# EAGLE design CC2-32KEC-V1RA (EAGLE 5.10)
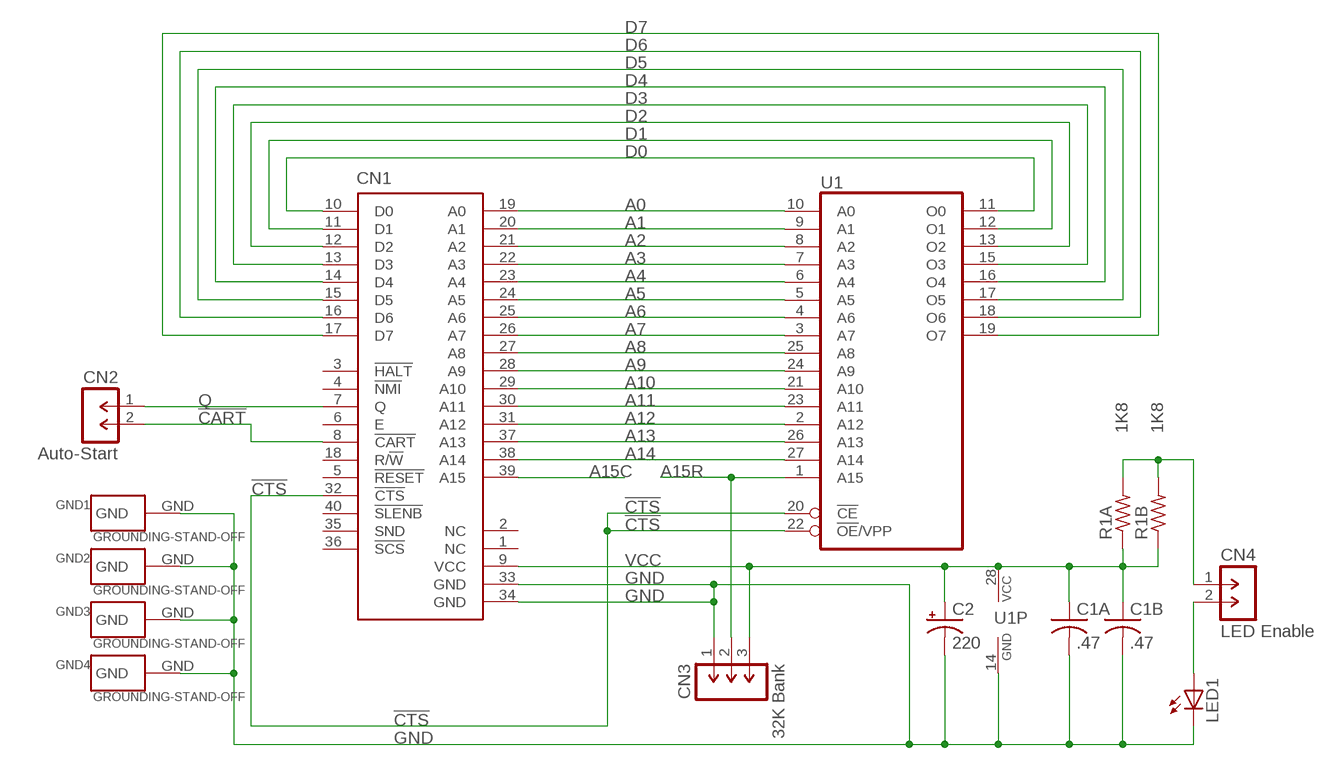
[diagram p0: schematic, sheet 1]

## Parts
C1A  .47  NP-CAPACITOR-C050-025X075  [C050-025X075]
C1B  .47  NP-CAPACITOR-C1206K  [C1206K]
C2  220  P-CAPACITOR-CPOL-RADIAL-1  [CPOL-RADIAL-1]
CN1  COCO3-CARTRIDGE-PLUG-SHORT  [EDGE-CARD-PLUG-2X20-100-SHORT]
CN2  Auto-Start  1X02-SIP-100-32  [SIL1X02-100]
CN3  32K Bank  1X03-SIP-100-32  [SIL1X03-100]
CN4  LED Enable  1X02-SIP-100-32  [SIL1X02-100]
GND1  GROUNDING-STAND-OFF  [STAND-OFF]
GND2  GROUNDING-STAND-OFF  [STAND-OFF]
GND3  GROUNDING-STAND-OFF  [STAND-OFF]
GND4  GROUNDING-STAND-OFF  [STAND-OFF]
LED1  LED5MM  [LED5MM]
R1A  1K8  R-US_0207/10  [0207/10]
R1B  1K8  R-US_M1206  [M1206]
U1  27C512D-MINIMAL-OUTLINE  [DIL28-6-MINIMAL-OUTLINE]

## Nets
!CART: CN1.8(!CART) CN2.2
!CTS: CN1.32(!CTS) U1.20(!CE) U1.22(!OE!/VPP)
A0: CN1.19(A0) U1.10(A0)
A1: CN1.20(A1) U1.9(A1)
A2: CN1.21(A2) U1.8(A2)
A3: CN1.22(A3) U1.7(A3)
A4: CN1.23(A4) U1.6(A4)
A5: CN1.24(A5) U1.5(A5)
A6: CN1.25(A6) U1.4(A6)
A7: CN1.26(A7) U1.3(A7)
A8: CN1.27(A8) U1.25(A8)
A9: CN1.28(A9) U1.24(A9)
A10: CN1.29(A10) U1.21(A10)
A11: CN1.30(A11) U1.23(A11)
A12: CN1.31(A12) U1.2(A12)
A13: CN1.37(A13) U1.26(A13)
A14: CN1.38(A14) U1.27(A14)
A15C: CN1.39(A15)
A15R: CN3.2 U1.1(A15)
D0: CN1.10(D0) U1.11(O0)
D1: CN1.11(D1) U1.12(O1)
D2: CN1.12(D2) U1.13(O2)
D3: CN1.13(D3) U1.15(O3)
D4: CN1.14(D4) U1.16(O4)
D5: CN1.15(D5) U1.17(O5)
D6: CN1.16(D6) U1.18(O6)
D7: CN1.17(D7) U1.19(O7)
GND [power]: C1A.2(-) C1B.2(-) C2.2(-) CN1.33(GND) CN1.34(GND) CN3.1 GND1.GND GND2.GND GND3.GND GND4.GND LED1.K(C) U1.14(GND)
N$1: CN4.1 R1A.2 R1B.2
N$2: CN4.2 LED1.A
Q: CN1.7(Q) CN2.1
VCC [power]: C1A.1(+) C1B.1(+) C2.1(+) CN1.9(VCC) CN3.3 R1A.1 R1B.1 U1.28(VCC)
Unconnected: CN1.1(NC) CN1.2(NC) CN1.3(!HALT) CN1.4(!NMI) CN1.5(!RESET) CN1.6(E) CN1.18(R/!W) CN1.35(SND) CN1.36(!SCS) CN1.40(!SLENB)

## Library data of the parts
C1A C1B = RetroZilla.org-Capacitor:NP-CAPACITOR: NON-POLARIZED CAPACITOR grid 5mm
C2 = RetroZilla.org-Capacitor:P-CAPACITOR: POLARIZED CAPACITOR Small Radial Electrolytic
CN1 = RetroZilla.org-TRS-80-CoCo-3-Program-Pak-Cartridge:COCO3-CARTRIDGE-PLUG: CoCo 3 Program Pak Cartridge Plug - http://www.GIMEchip.com/ Tandy Radio Shack TRS-80 Color Computer 3 Program Pak Cartridge Plug (Edge-Card) E.A.G.L.E. Library Part created by John Eric Turner & His Father - sales@gimechip.com <mailto:sales@gimechip.com?subject=Tandy Radio Shack TRS- 80 Color Computer 3 Program Pak Cartridge Plug (Edge-Card) E.A.G.L.E. Library Part> 40-Pin Edge-Card sharing the same pinout as the Program Pak Cartridge Edge-Card Connector. This library part has been designed to provide a 40-pin cartridge plug connector matching the CoCo's Edge-Card connector (Cartridge Slot). This library part is also useful with the Dragon and other CoCo clones. It is important to note that the CoCo 2 & 3 only provide +5V at the cartridge connector. The CoCo 1 provides +5V AND +/-12V at the cartridge connector. The Dragon provides only +5V and +12V at the cartridge connector. The table below lists all similarities and differences between these machines, relevant to the cartridge slot: PIN # TRS-80 "CoCo 1" Function Tano/Dragon Data "Dragon 32/64" Function TRS-80 "CoCo 2 & 3" Function 1 -12V +12V NC 2 +12V +12V NC 3 HALT* HALT* HALT* 4 NMI* NMI* NMI* 5 RESET* RESET* RESET* 6 E E E 7 Q Q Q 8 CART* CART* CART* 9 +5V +5V +5V 10 D0 D0 D0 11 D1 D1 D1 12 D2 D2 D2 13 D3 D3 D3 14 D4 D4 D4 15 D5 D5 D5 16 D6 D6 D6 17 D7 D7 D7 18 R/W* R/W* R/W* 19 A0 A0 A0 20 A1 A1 A1 21 A2 A2 A2 22 A3 A3 A3 23 A4 A4 A4 24 A5 A5 A5 25 A6 A6 A6 26 A7 A7 A7 27 A8 A8 A8 28 A9 A9 A9 29 A10 A10 A10 30 A11 A11 A11 31 A12 A12 A12 32 CTS* CSEL* CTS* 33 GND GND GND 34 GND GND GND 35 SND SND SND 36 SCS* P2* SCS* 37 A13 A13 A13 38 A14 A14 A14 39 A15 A15 A15 40 SLENB* DSD* SLENB*
CN2 CN4 = RetroZilla.org-Header-Generic:1X02: MALE HEADER
CN3 = RetroZilla.org-Header-Generic:1X03: MALE HEADER
GND1-GND4 = RetroZilla.org-TRS-80-CoCo-3-Program-Pak-Cartridge:GROUNDING
LED1 = RetroZilla.org-LED:LED: LED OSRAM: - CHIPLED LG R971, LG N971, LY N971, LG Q971, LY Q971, LO R971, LY R971 LH N974, LH R974 LS Q976, LO Q976, LY Q976 LO Q996 - Hyper CHIPLED LW Q18S LB Q993, LB Q99A, LB R99A - SideLED LS A670, LO A670, LY A670, LG A670, LP A670 LB A673, LV A673, LT A673, LW A673 LH A674 LY A675 LS A676, LA A676, LO A676, LY A676, LW A676 LS A679, LY A679, LG A679 - Hyper Micro SIDELED® LS Y876, LA Y876, LO Y876, LY Y876 LT Y87S - SmartLED LW L88C, LW L88S LB L89C, LB L89S, LG L890 LS L89K, LO L89K, LY L89K LS L896, LA L896, LO L896, LY L896 - TOPLED LS T670, LO T670, LY T670, LG T670, LP T670 LSG T670, LSP T670, LSY T670, LOP T670, LYG T670 LG T671, LOG T671, LSG T671 LB T673, LV T673, LT T673, LW T673 LH T674 LS T676, LA T676, LO T676, LY T676, LB T676, LH T676, LSB T676, LW T676 LB T67C, LV T67C, LT T67C, LS T67K, LO T67K, LY T67K, LW E67C LS E67B, LA E67B, LO E67B, LY E67B, LB E67C, LV E67C, LT E67C LW T67C LS T679, LY T679, LG T679 LS T770, LO T770, LY T770, LG T770, LP T770 LB T773, LV T773, LT T773, LW T773 LH T774 LS E675, LA E675, LY E675, LS T675 LS T776, LA T776, LO T776, LY T776, LB T776 LHGB T686 LT T68C, LB T68C - Hyper Mini TOPLED® LB M676 - Mini TOPLED Santana® LG M470 LS M47K, LO M47K, LY M47K Source: http://www.osram.convergy.de/
R1A R1B = RetroZilla.org-RCL:R-US_: RESISTOR, American symbol
U1 = RetroZilla.org-EPROM:27C512D: MEMORY

## Net classes
0 default: width 0.203 mm, clearance 0.203 mm
1 power: width 0.635 mm, clearance 0.203 mm

## Board
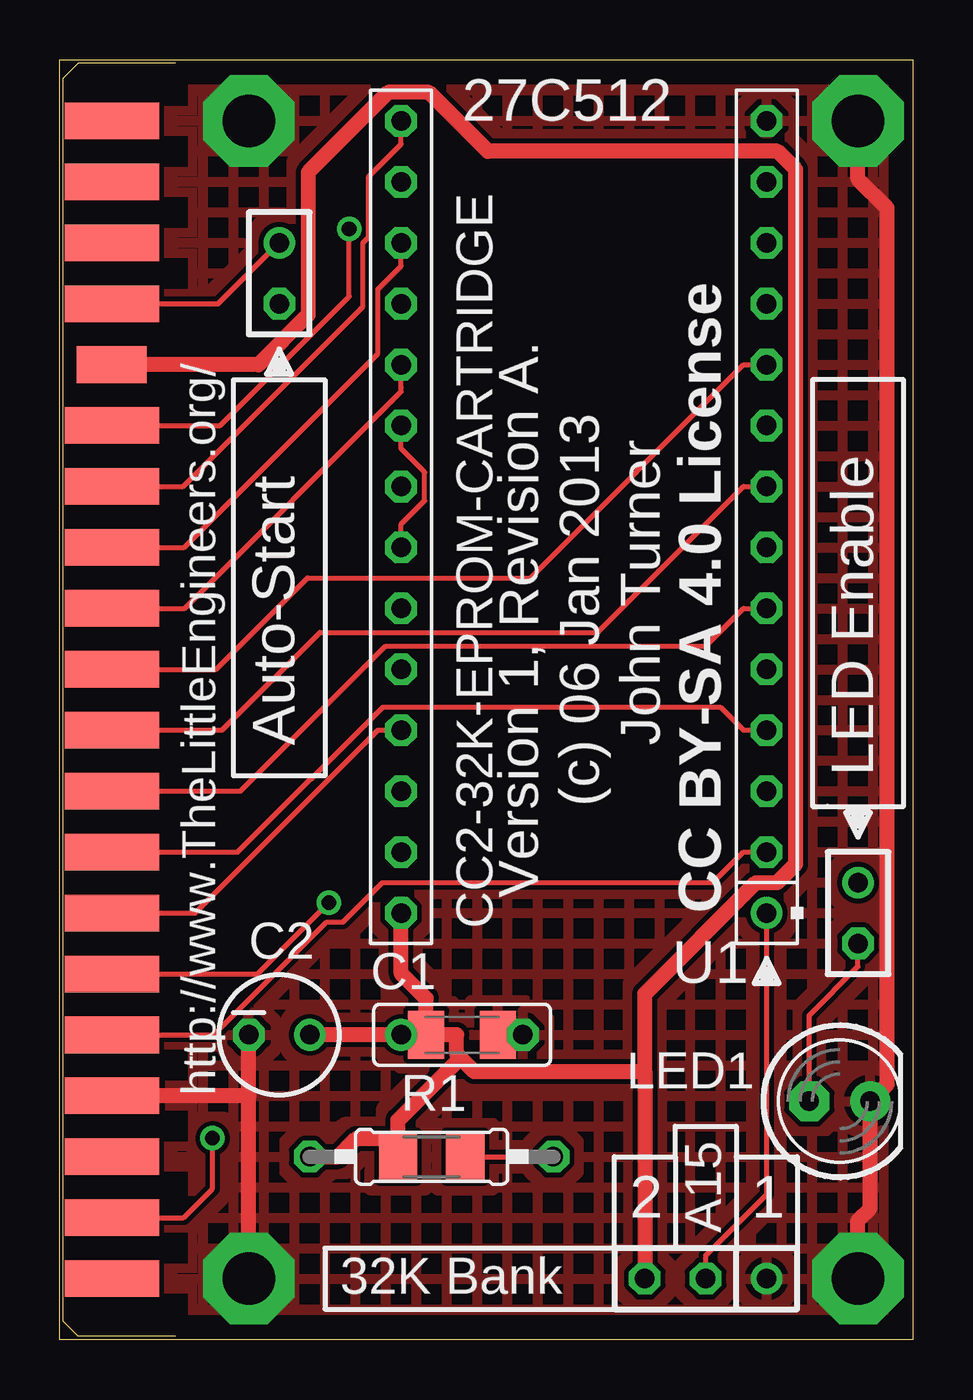
[diagram p1: board, top side]
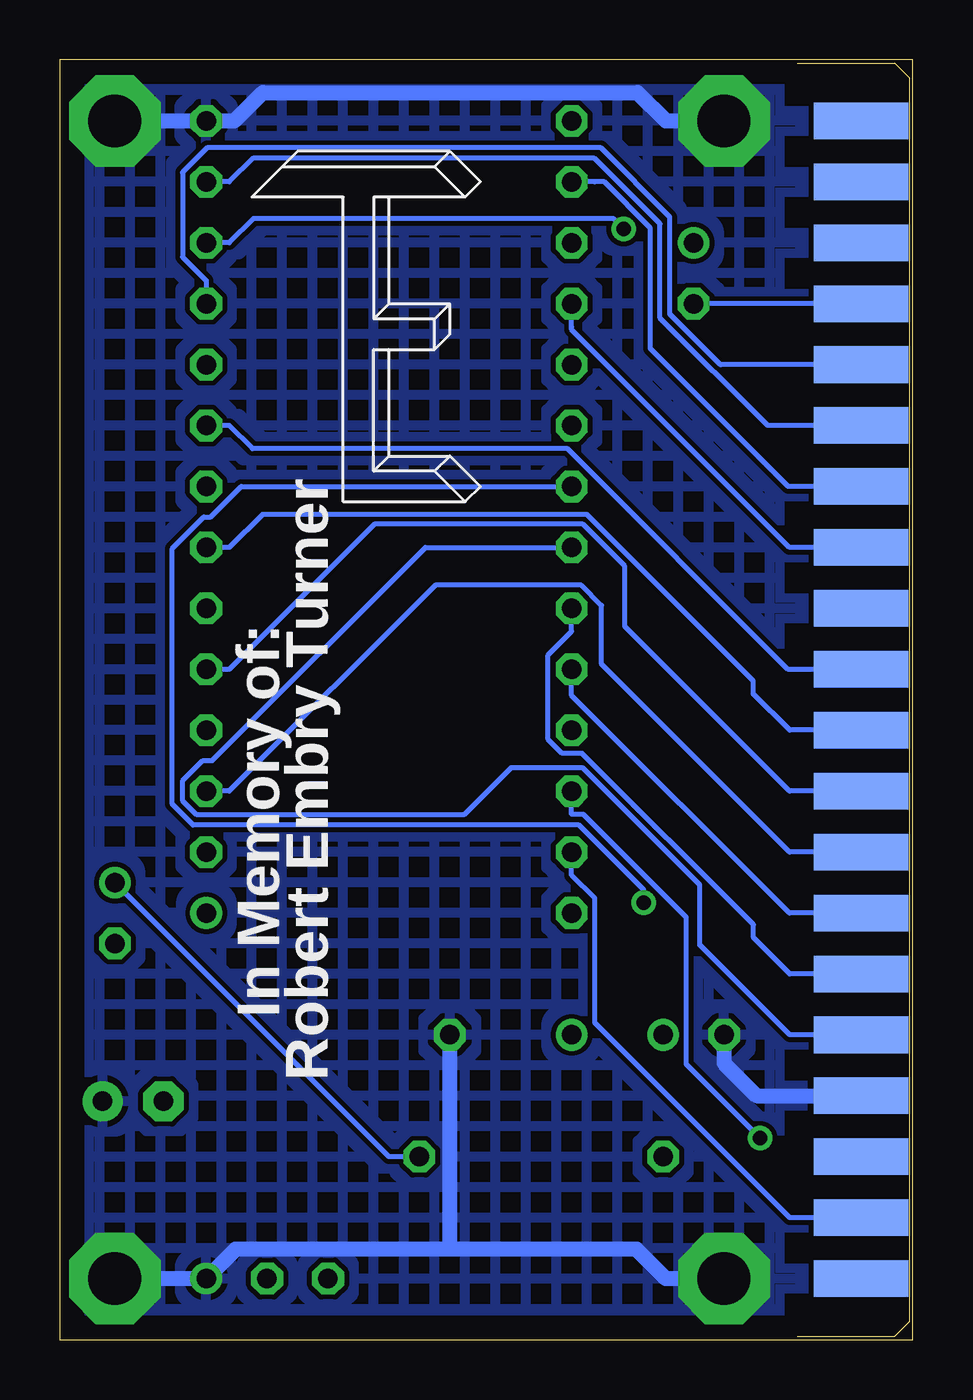
[diagram p2: board, bottom side, seen from below]

Size 35.56 x 53.34 mm. Coordinates in mm from the lower left corner, seen from the top.
Outline: 0,53.34 35.56,53.34 35.56,0 0,0 0,53.34
Copper layers (1*16): Top 0.035mm / dielectric 1.5mm / Bottom 0.035mm
Design rules "default": minimum track width 10mil, minimum drill 24mil, track to track 8mil, track to pad 8mil, pad to pad 8mil, via to via 8mil, smd to smd 8mil, copper to edge 40mil, drill to drill 8mil, minimum pad ring 10mil, minimum via ring 8mil, stop-mask expansion 4mil, vias tented up to drill 0mil, thermal gap 10mil
vRestrict: area 15.5,14 to 28.2,53.3; area 23.1,3.8 to 30.7,7.6; area 9.1,0 to 23.1,5.1; area 30.7,20.3 to 35.8,48.3; area 7.9,16.5 to 10.4,41.9

### Footprints (pad centres in the part's own frame; a part is rotated, then mirrored left to right if it is on the bottom)
C050-025X075 = drill 0.813 round: 1 -2.54,0 | drill 0.813 octagon: 2 2.54,0
C1206K = smd 1.5 x 2: 1 -1.5,0; 2 1.5,0
CPOL-RADIAL-1 = drill 0.813 round: 1 1.27,0 | drill 0.813 octagon: 2 -1.27,0
EDGE-CARD-PLUG-2X20-100-SHORT = smd 3.937 x 1.524: 1 3.175,24.13; 3 3.175,21.59; 5 3.175,19.05; 7 3.175,16.51; 11 3.175,11.43; 13 3.175,8.89; 15 3.175,6.35; 17 3.175,3.81; 19 3.175,1.27; 21 3.175,-1.27; 23 3.175,-3.81; 25 3.175,-6.35; 27 3.175,-8.89; 29 3.175,-11.43; 31 3.175,-13.97; 33 3.175,-16.51; 35 3.175,-19.05; 37 3.175,-21.59; 39 3.175,-24.13 | smd 3.937 x 1.524 bottom: 2 3.175,24.13; 4 3.175,21.59; 6 3.175,19.05; 8 3.175,16.51; 10 3.175,13.97; 12 3.175,11.43; 14 3.175,8.89; 16 3.175,6.35; 18 3.175,3.81; 20 3.175,1.27; 22 3.175,-1.27; 24 3.175,-3.81; 26 3.175,-6.35; 28 3.175,-8.89; 30 3.175,-11.43; 32 3.175,-13.97; 34 3.175,-16.51; 36 3.175,-19.05; 38 3.175,-21.59; 40 3.175,-24.13 | smd 2.921 x 1.524: 9 3.175,13.97
SIL1X02-100 = drill 0.813 round: 1 -1.27,0 | drill 0.813 octagon: 2 1.27,0
SIL1X03-100 = drill 0.813 round: 1 -2.54,0 | drill 0.813 octagon: 2 0,0; 3 2.54,0
STAND-OFF = drill 2.2 pad 3.81 octagon: GND 0,0
LED5MM = drill 0.813 pad 1.676 octagon: A -1.27,0 | drill 0.813 pad 1.676 round: K 1.27,0
0207/10 = drill 0.813 octagon: 1 -5.08,0; 2 5.08,0
M1206 = smd 1.6 x 2: 1 -1.4,0; 2 1.4,0
DIL28-6-MINIMAL-OUTLINE = drill 0.813 round: 1 -16.51,-7.62 | drill 0.813 octagon: 2 -13.97,-7.62; 3 -11.43,-7.62; 4 -8.89,-7.62; 5 -6.35,-7.62; 6 -3.81,-7.62; 7 -1.27,-7.62; 8 1.27,-7.62; 9 3.81,-7.62; 10 6.35,-7.62; 11 8.89,-7.62; 12 11.43,-7.62; 13 13.97,-7.62; 14 16.51,-7.62; 15 16.51,7.62; 16 13.97,7.62; 17 11.43,7.62; 18 8.89,7.62; 19 6.35,7.62; 20 3.81,7.62; 21 1.27,7.62; 22 -1.27,7.62; 23 -3.81,7.62; 24 -6.35,7.62; 25 -8.89,7.62; 26 -11.43,7.62; 27 -13.97,7.62; 28 -16.51,7.62

### Placement (x,y rotation side)
C1A  16.76,12.7 0 top
C1B  16.76,12.7 0 top
C2  9.14,12.7 0 top
CN1  -1.02,26.67 0 top
CN2  9.14,44.45 270 top
CN3  26.92,2.54 180 top
CN4  33.27,17.78 270 top
GND1  7.87,50.8 0 top
GND2  33.27,50.8 0 top
GND3  7.87,2.54 0 top
GND4  33.27,2.54 0 top
LED1  32.51,9.93 0 top
R1A  15.49,7.62 0 top
R1B  15.49,7.62 0 top
U1  21.84,34.29 90 top
U$1  [TLE-LOGO-7]  27.56,34.92 0 bottom

### Tracks (layer width: path | path; a pad name or v marks a point on that pad's centre or on a via)
!CART
  Bottom 0.203: CN1.8 CN2.2
!CTS
  Top 0.203: U1.20 14.22,37.13 15.21,36.15 15.21,34.97 14.22,33.98 U1.22
  Bottom 0.203: U1.22 20.32,33.02 29.21,24.13 29.61,24.13 30.44,23.3 30.44,22.46 29.86,21.87 18.71,21.87 16.76,23.83 13.76,23.83 8.88,18.95 8.88,16.45 5.14,12.7 CN1.32
A0
  Top 0.203: U1.10 28.5,40.64 19.61,31.75 10.31,31.75 6.5,27.94 CN1.19
A1
  Bottom 0.203: U1.9 28.5,38.1 27.53,37.13 14.4,37.13 5.21,27.94 CN1.20
A2
  Top 0.203: U1.8 28.5,35.56 22.42,29.48 10.84,29.48 6.76,25.4 CN1.21
A3
  Bottom 0.203: U1.7 28.5,33.02 27.12,34.4 13.59,34.4 6.65,27.46 6.65,26.92 5.13,25.4 CN1.22
A4
  Top 0.203: CN1.23 7.53,22.86 13.57,28.91 26.92,28.91 28.5,30.48 U1.6
A5
  Bottom 0.203: CN1.24 5.14,22.86 12,29.72 12,32.24 13.75,33.99 22.45,33.99 28.5,27.94 U1.5
A6
  Top 0.203: CN1.25 4.43,20.32 7.42,20.32 13.46,26.37 27.53,26.37 28.5,25.4 U1.4
A7
  Bottom 0.203: U1.3 28.5,22.86 19.91,31.45 13.83,31.45 12.98,30.6 12.98,28.16 5.14,20.32 CN1.26
A8
  Top 0.203: CN1.27 5.64,17.78 13.26,25.4 U1.25
A9
  Bottom 0.203: U1.24 14.22,26.86 5.15,17.78 CN1.28
A10  (via drill 0.61 pad 1.02)
  Top 0.203: v11.22,18.22 8.24,15.24 CN1.29
  Bottom 0.203: U1.21 28,35.56 29.27,34.29 29.56,34.29 30.88,32.97 30.88,22.32 30.01,21.45 13.92,21.45 11.22,18.75 v11.22,18.22
A11
  Bottom 0.203: U1.23 14.22,29.52 15.21,28.53 15.21,25.02 14.62,24.43 13.79,24.43 6.65,17.3 6.65,16.76 5.13,15.24 CN1.30
A12
  Top 0.203: CN1.31 6.42,12.7 11.12,17.4 11.79,17.4 13.44,19.05 27.23,19.05 28.5,20.32 U1.2
A13  (via drill 0.61 pad 1.02)
  Top 0.203: v6.36,8.39 6.36,6.29 5.15,5.08 CN1.37
  Bottom 0.203: U1.26 14.22,21.89 13.74,21.89 9.45,17.6 9.45,11.48 v6.36,8.39
A14
  Bottom 0.203: U1.27 14.22,19.36 13.26,18.39 13.26,13.21 5.13,5.08 CN1.38
A15R
  Top 0.203: CN3.2 26.92,3.5 29.46,6.04 U1.1
D0
  Bottom 0.203: U1.11 29.46,44.15 30.45,45.13 30.45,48.66 29.43,49.67 13.01,49.67 10.13,46.8 10.13,42.76 8.02,40.64 CN1.10
D1  (via drill 0.61 pad 1.02)
  Top 0.203: CN1.11 6.68,38.1 12.06,43.48 v12.06,46.3
  Bottom 0.203: v12.06,46.3 12.49,46.73 27.49,46.73 28.5,45.72 U1.12
D2
  Bottom 0.203: CN1.12 6.05,38.1 10.54,42.59 10.54,46.51 13.28,49.24 27.52,49.24 28.5,48.26 U1.13
D3
  Top 0.203: CN1.13 5.13,35.56 12.63,43.06 12.63,45.72 12.87,45.96 12.87,48.48 14.22,49.84 U1.15
D4
  Bottom 0.203: CN1.14 5.19,35.56 10.95,41.31 10.95,46.34 12.87,48.26 13.26,48.26 | 13.26,48.26 | 13.26,48.26 U1.16
D5
  Top 0.203: U1.17 14.22,44.76 13.26,43.79 13.26,41.11 5.17,33.02 CN1.15
D6
  Bottom 0.203: U1.18 14.22,42.22 14.22,42.1 5.14,33.02 CN1.16
D7
  Top 0.203: U1.19 14.22,39.67 14.22,39.51 5.2,30.48 CN1.17
GND
  Top 0.635: GND2.GND 33.27,48.37 34.48,47.16 34.48,10.63 LED1.K 33.78,5.47 33.27,4.97 GND4.GND | 7.87,10.16 C2.2 | 7.87,10.16 CN1.34 | GND3.GND 7.87,10.16 | C1A.2 C1B.2
  Bottom 0.635: 19.3,3.76 11.52,3.76 10.3,2.54 GND3.GND | 19.3,3.76 28.24,3.76 CN3.1 GND4.GND | 19.3,3.76 C1A.2 | C2.2 7.87,11.52 6.51,10.16 CN1.34 | GND1.GND 10.3,50.8 11.48,51.98 27.1,51.98 28.28,50.8 U1.14 GND2.GND
  pour Top (hatched): 0.25,53.34 35.81,53.34 35.81,0 0.25,0
  pour Bottom (hatched): 0.25,53.34 35.81,53.34 35.81,0 0.25,0
N$1
  Top 0.203: R1B.2 R1A.2
  Bottom 0.203: R1A.2 21.84,7.62 CN4.1
N$2
  Top 0.203: CN4.2 33.27,15.54 31.24,13.51 LED1.A
Q
  Top 0.203: CN2.1 6.6,43.18 CN1.7
VCC
  Top 0.635: 24.38,11.17 24.38,14.41 29.02,19.05 29.9,19.05 30.68,19.82 30.68,48.78 29.93,49.53 17.84,49.53 15.38,51.99 13.68,51.99 10.35,48.66 10.35,42.71 8.28,40.64 CN1.9 | C1B.1 15.26,14.22 14.22,15.26 U1.28 | 16.7,11.74 17.27,11.17 24.38,11.17 | 16.7,11.74 16.54,11.91 16.54,12.7 C1B.1 | 16.7,11.74 14.09,9.14 14.09,8.38 | R1A.1 11.6,7.62 12.36,8.38 14.09,8.38 | 14.09,8.38 R1B.1 | 24.38,11.17 CN3.3 | C1B.1 C1A.1 C2.1

### Text on the board
tPlace: CC BY-SA 4.0 License
bPlace: In Memory of: | Robert Embry Turner
tNames: 27C512 | Auto-Start | John Turner | LED Enable | (c) 06 Jan 2013 | Version 1, Revision A. | CC2-32K-EPROM-CARTRIDGE | C2 | C1 | http://www.TheLittleEngineers.org/ | R1 | 2 | 1 | A15 | 32K Bank